# EasyEDA schematic Nervo Board InMoov.json
TITLE: Right Hand; REV: 1.0; Date: 2020-07-03; Sheet: 1/1; Company: Your Company
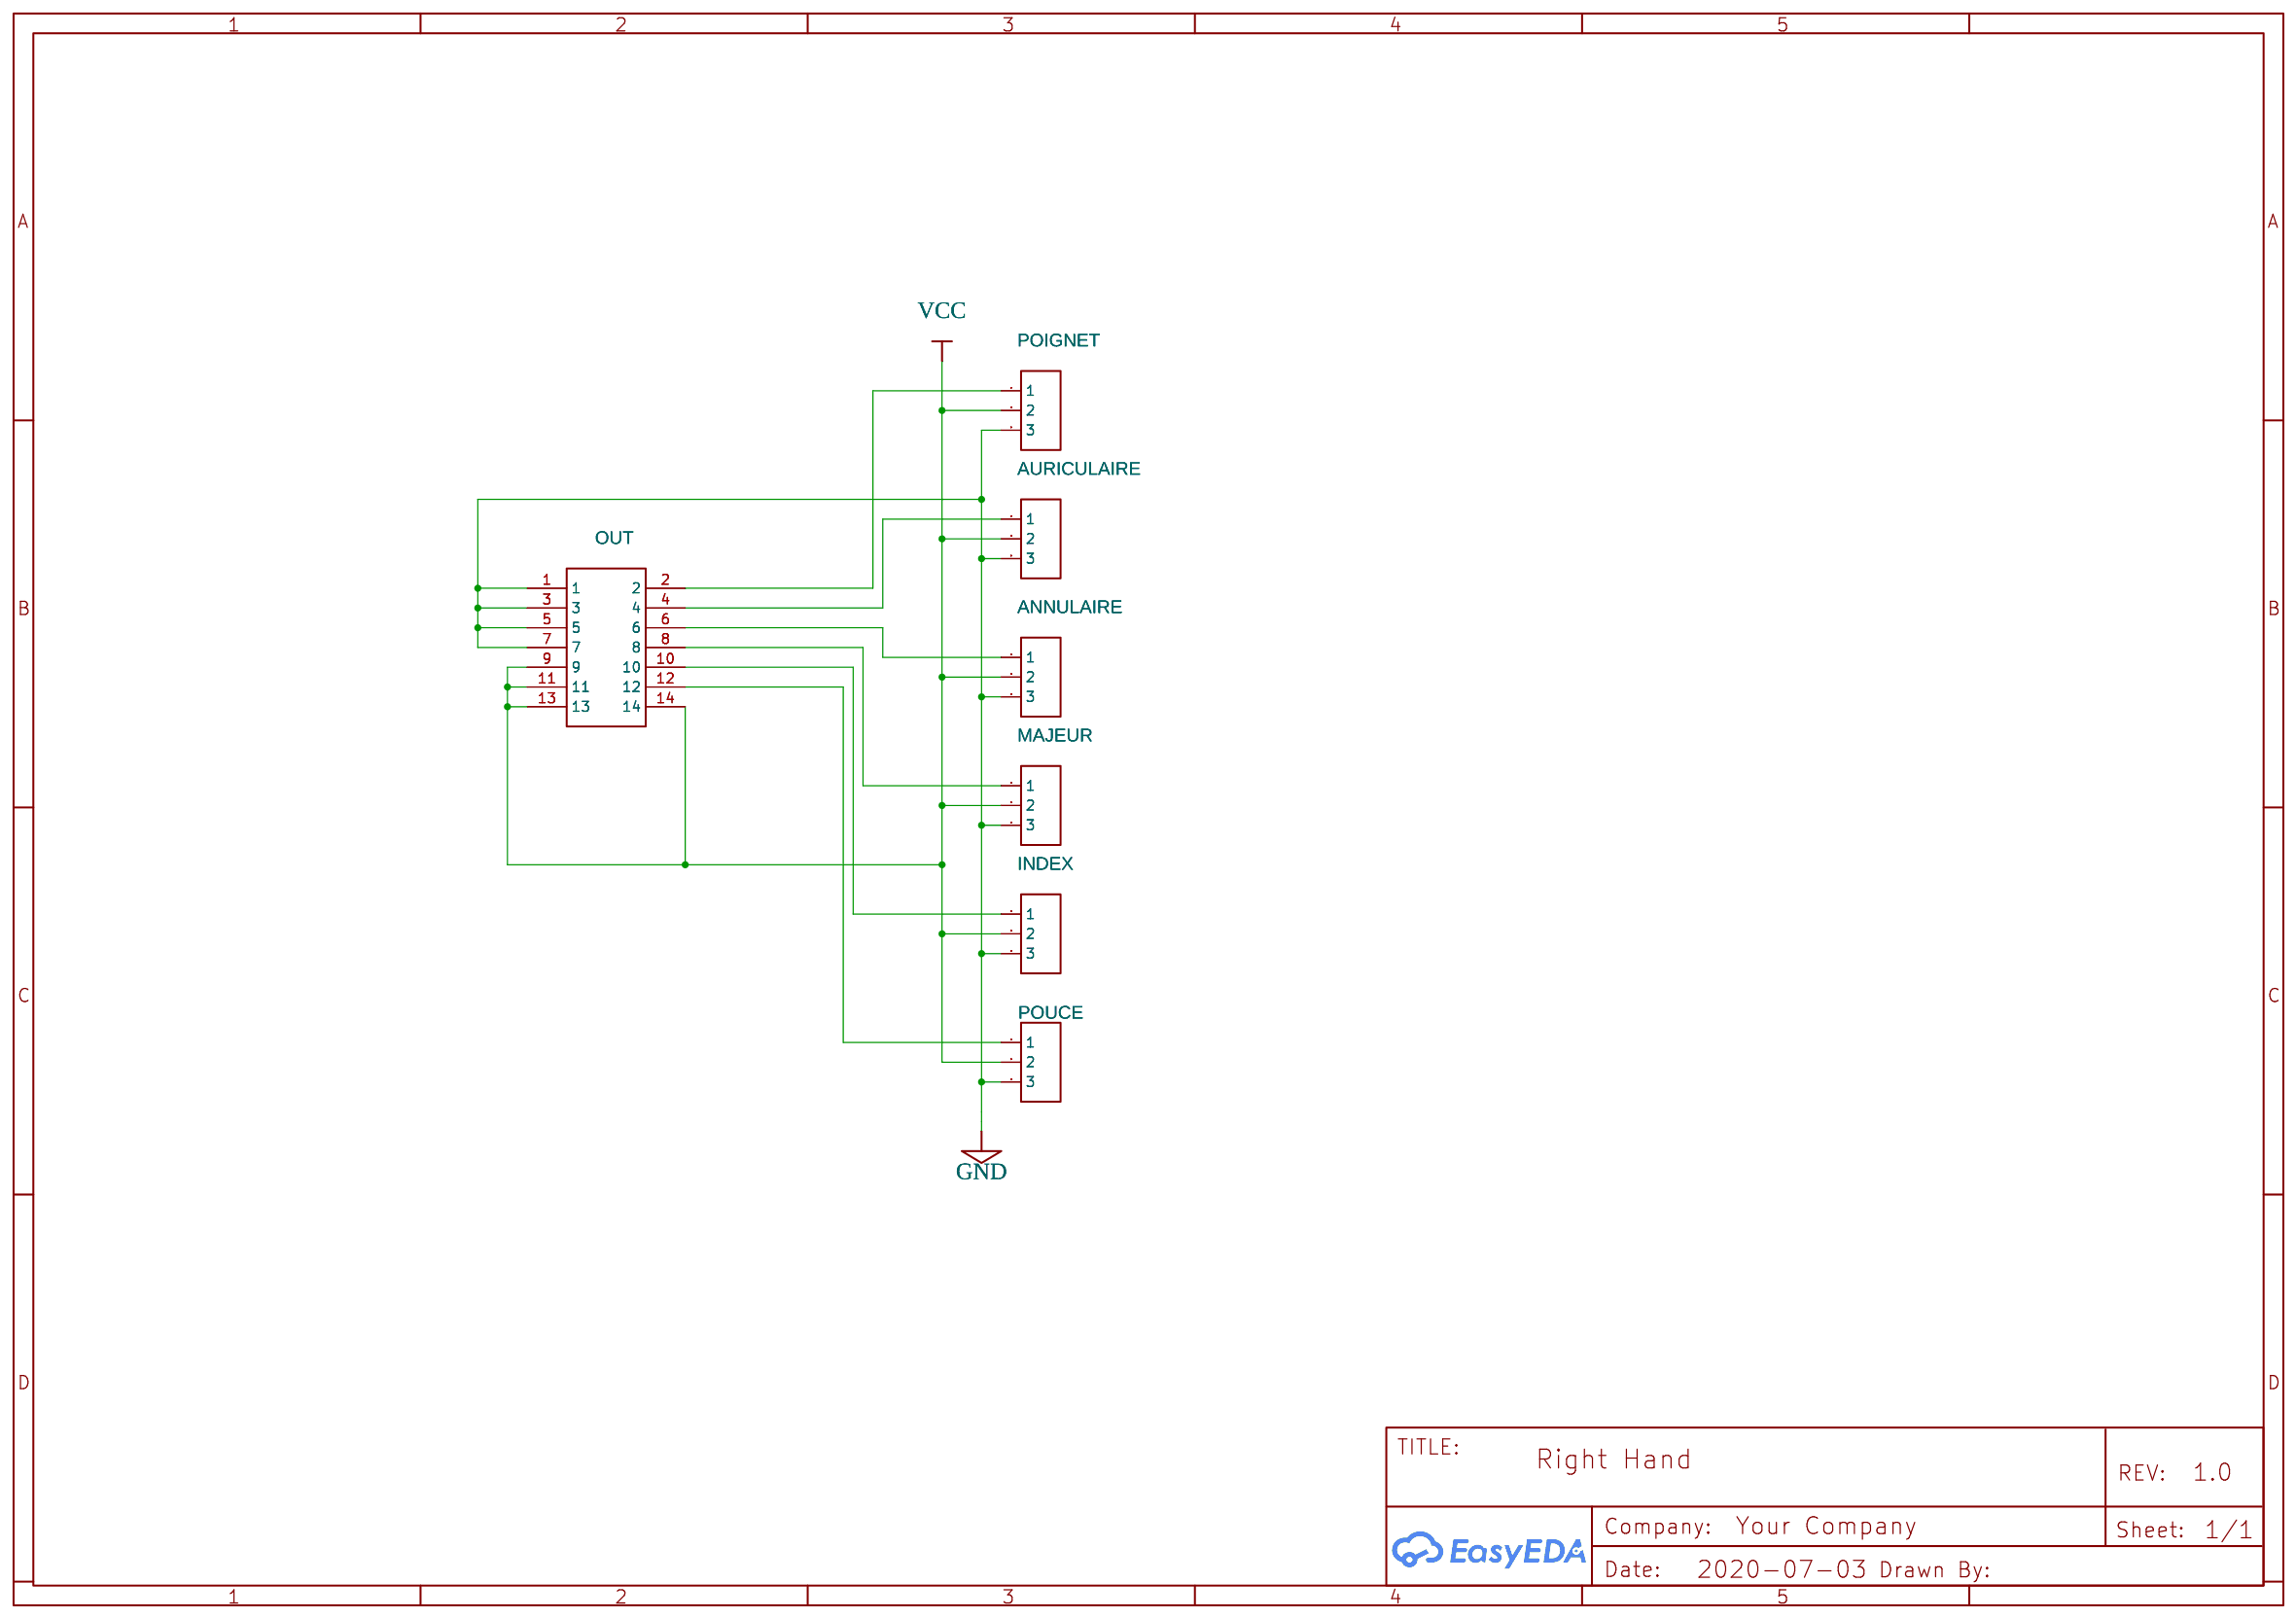
[diagram p0: schematic sheet]

## Parts
ANNULAIRE  1  [HDR-TH_3P-P2.54-V]
AURICULAIRE  1  [HDR-TH_3P-P2.54-V]
INDEX  1  [HDR-TH_3P-P2.54-V]
MAJEUR  1  [HDR-TH_3P-P2.54-V]
OUT  Horn connector/2.0mm2*7P  [IDC-TH_14P-P2.00-V-M-R2-C7-S2.00]
POIGNET  1  [HDR-TH_3P-P2.54-V]
POUCE  1  [HDR-TH_3P-P2.54-V]

## Library data of the parts
ANNULAIRE AURICULAIRE INDEX MAJEUR POIGNET = Header-Male-2.54_1x3: Supplier: LCSC; Manufacturer: BOOMELE; Manufacturer Part: Header2.54mm 1*3P; image: //image.lceda.cn/szlcsc/C49257.jpg; Supplier Part: C49257
OUT = Horn connector/2.0mm2*7P: Supplier: LCSC; Manufacturer: BOOMELE; Manufacturer Part: Horn connector/2.0mm2*7P直简牛; Supplier Part: C29428
POUCE = Header-Male-2.54_1x3: Supplier: LCSC; Manufacturer: BOOMELE; Manufacturer Part: Header2.54mm 1*3P; image: //image.lceda.cn/szlcsc/C49257.jpg; Supplier Part: C49257; Package Display: No

## Nets
GND: ANNULAIRE.3 AURICULAIRE.3 INDEX.3 MAJEUR.3 OUT.1 OUT.3 OUT.5 OUT.7 POIGNET.3 POUCE.3
VCC: ANNULAIRE.2 AURICULAIRE.2 INDEX.2 MAJEUR.2 OUT.9 OUT.11 OUT.13 OUT.14 POIGNET.2 POUCE.2
Net-(ANNULAIRE-1): ANNULAIRE.1 OUT.6
Net-(AURICULAIRE-1): AURICULAIRE.1 OUT.4
Net-(INDEX-1): INDEX.1 OUT.10
Net-(MAJEUR-1): MAJEUR.1 OUT.8
Net-(OUT-2): OUT.2 POIGNET.1
Net-(OUT-12): OUT.12 POUCE.1
